# Altium project Audio IO Switch.PrjPCB
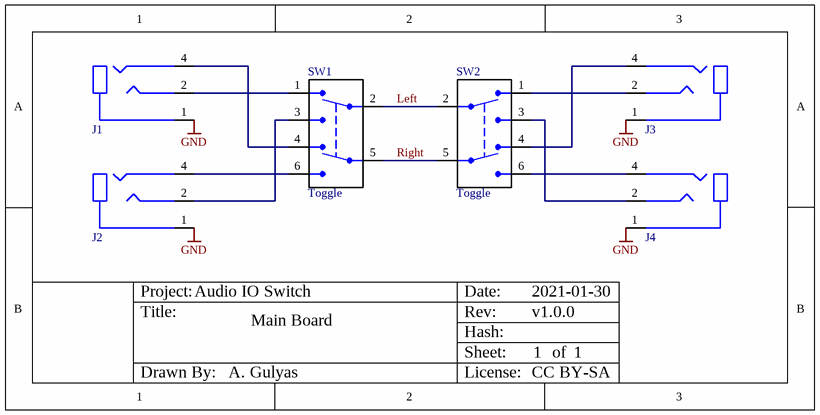
[diagram p0: Audio IO Switch - SCH.SchDoc]
1 sheet, 6 parts. Net scope: global (net labels, ports and power ports of the same name join across sheets).
Board file: Audio IO Switch - PCB.PcbDoc

## Sheet Audio IO Switch - SCH.SchDoc
size 152 x 76 mm; Date: 2021-01-30; DrawnBy: A. Gulyas; Revision: v1.0.0; SheetNumber: 1; SheetTotal: 1

### Parts
J1  Jack - TRS - 35RAPC2BV4  [Jack - TRS - MJ-3502]  (value not drawn)
J2  Jack - TRS - 35RAPC2BV4  [Jack - TRS - MJ-3502]  (value not drawn)
J3  Jack - TRS - 35RAPC2BV4  [Jack - TRS - MJ-3502]  (value not drawn)
J4  Jack - TRS - 35RAPC2BV4  [Jack - TRS - MJ-3502]  (value not drawn)
SW1  Toggle  [SW - toggle - RA - 100DP1T1B1M6QE]
SW2  Toggle  [SW - toggle - RA - 100DP1T1B1M6QE]

### Nets
GND: J1.1 J2.1 J3.1 J4.1
Left: SW1.2 SW2.2
Right: SW1.5 SW2.5
NetJ1_2: J1.2 SW1.1
NetJ1_4: J1.4 SW1.4
NetJ2_2: J2.2 SW1.3
NetJ2_4: J2.4 SW1.6
NetJ3_2: J3.2 SW2.1
NetJ3_4: J3.4 SW2.4
NetJ4_2: J4.2 SW2.3
NetJ4_4: J4.4 SW2.6

### Notes on the sheet
- Project:
- Audio IO Switch
- Date:
- Title:
- Main Board
- Rev:
- Hash:
- Sheet:
- of
- Drawn By:
- License:
- CC BY-SA

### Library data of the parts
J1-J4 = Jack - TRS - 35RAPC2BV4: CONN JACK STEREO 3.5MM R/A; MFG: Switchcraft; Signal Lines: Stereo (3 Conductor, TRS); Gender: Female; Connector Type: Phone Jack; Industry Recognized Mating Diameter: 3.50mm (0.141"", 1/8"", Mini Plug) - Headphone; Actual Diameter: 0.142"" (3.60mm); Number of Positions/Contacts: 3 Conductors, 3 Contacts; Internal Switch(s): Does Not Contain Switch; Shielding: Unshielded; Includes: 3 pcs - 1 Connector, 1 Nut, 1 Washer; ComponentLink1Description: Datasheet; ComponentLink1URL: E:\!Projects\52 Audio IO Switch\Datasheets\Switchcraft - TRS - 35RAPC2BV4.pdf; ComponentLink2Description: Online Datasheet; ComponentLink2URL: https://www.switchcraft.com/Drawings/35rapc__v4_cd.pdf; MFG PN: 35RAPC2BV4; Mounting Type: Panel Mount, Through Hole, Right Angle; Features: Mounting Hardware, Thread Lock; Housing Material: Polybutylene Terephthalate (PBT), Glass Filled
  J1: Digi-Key PN: SC1460-ND
  J2-J4: Digi-Key PN: Switchcraft Inc.
SW1 SW2 = SW - DPDT - 100DP1T1B1M6QE: SWITCH TOGGLE DPDT 5A 120V; MFG: E-Switch; Switch Function: On-On; Op Temp: -30°C ~ 85°C; Electrical Life: 40,000 Cycles; Voltage Rating - DC: 28V; ComponentLink1Description: Datasheet; ComponentLink1URL: E:\!Projects\52 Audio IO Switch\Datasheets\E-Switch - 100DP1T1B1M6QE.pdf; ComponentLink2Description: Online Datasheet; ComponentLink2URL: http://spec_sheets.e-switch.com/specs/T121059.pdf; Digi-Key PN: 100DP1T1B1M6QE-ND; MFG PN: 100DP1T1B1M6QE; Circuit: DPDT; Mounting Type: Panel Mount, Right Angle; Series: 100; Panel Cutout Dimensions: Circular - 6.35mm Dia; Bushing Thread: 1/4-40